# EAGLE design ZigFlea_v6 (EAGLE 5.08)
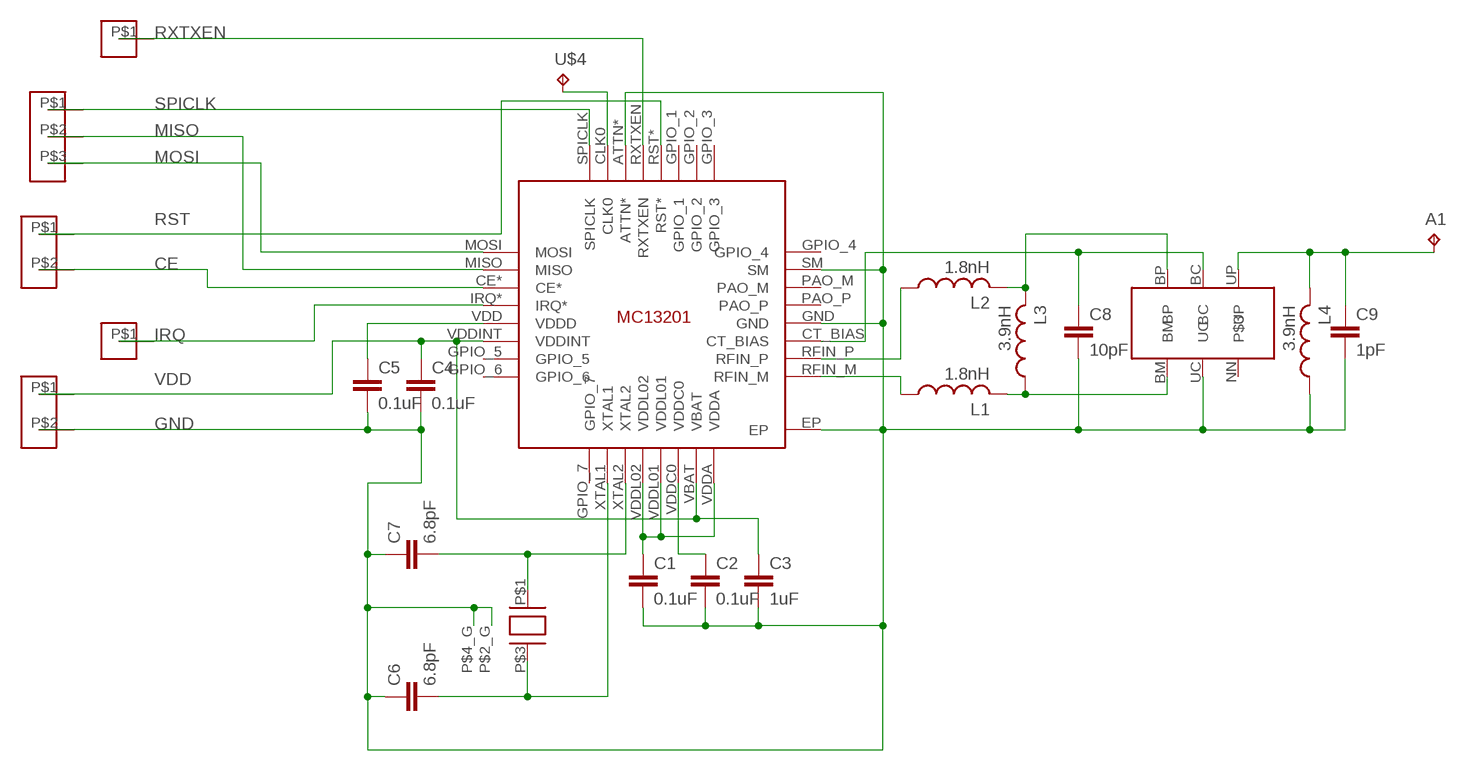
[diagram p0: schematic, sheet 1]

## Parts
A1  TPTP06SQ  [TP06SQ]
C1  0.1uF  C-EUC0603  [C0603]
C2  0.1uF  C-EUC0603  [C0603]
C3  1uF  C-EUC0603  [C0603]
C4  0.1uF  C-EUC0603  [C0603]
C5  0.1uF  C-EUC0603  [C0603]
C6  6.8pF  C-EUC0603  [C0603]
C7  6.8pF  C-EUC0603  [C0603]
C8  10pF  C-EUC0603  [C0603]
C9  1pF  C-EUC0603  [C0603]
L1  1.8nH  SPOLE0603  [SPOLE0603]
L2  1.8nH  SPOLE0603  [SPOLE0603]
L3  3.9nH  SPOLE0603  [SPOLE0603]
L4  3.9nH  SPOLE0603  [SPOLE0603]
RD8  PINHEAD1_1MM  [PINHEAD_1MM]
RE4  PINHEAD1_1MM  [PINHEAD_1MM]
U$1  MC13201  [MC13201]
U$2  16MHZ  [16MHZ]
U$3  BALUN  [BALUN]
U$4  TPTP06SQ  [TP06SQ]
U$5  PINHEAD3_1MM  [PINHEAD3_1MM]
U$6  PINHEAD2_1MM  [PINHEAD2_1MM]
U$7  PINHEAD2_1MM  [PINHEAD2_1MM]

## Nets
A1: A1.TP C9.1 L4.P$2 U$3.UP
CE: U$1.CE* U$6.P$2
GND: C1.2 C2.2 C3.2 C4.2 C5.2 C6.1 C7.1 C8.2 C9.2 L4.P$1 U$1.ATTN* U$1.EP U$1.GND U$1.SM U$2.P$2_G(P$3_G) U$2.P$4_G U$3.UC U$7.P$2
IRQ: RD8.P$1 U$1.IRQ*
MISO: U$1.MISO U$5.P$2
MOSI: U$1.MOSI U$5.P$3
N$1: C1.1 U$1.VDDA U$1.VDDL01 U$1.VDDL02
N$2: C2.1 U$1.VDDC0
N$3: U$1.CLK0 U$4.TP
N$4: C7.2 U$1.XTAL2 U$2.P$1
N$6: L1.P$1 U$1.RFIN_M
N$7: L2.P$1 U$1.RFIN_P
N$8: C5.1 U$1.VDD(VDDD)
N$9: C6.2 U$1.XTAL1 U$2.P$3
N$10: C8.1 U$1.CT_BIAS U$3.BC
N$11: L1.P$2 L3.P$1 U$3.BM
N$12: L2.P$2 L3.P$2 U$3.BP
RST: U$1.RST* U$6.P$1
RXTXEN: RE4.P$1 U$1.RXTXEN
SPICLK: U$1.SPICLK U$5.P$1
VDD: C3.1 C4.1 U$1.VBAT U$1.VDDINT U$7.P$1
Unconnected: U$1.GPIO_1 U$1.GPIO_2 U$1.GPIO_3 U$1.GPIO_4 U$1.GPIO_5 U$1.GPIO_6 U$1.GPIO_7 U$1.PAO_M U$1.PAO_P U$3.NN

## Library data of the parts
A1 U$4 = testpad:TP: Test pad
C1-C9 = resistor:C-EU: CAPACITOR, European symbol
L1-L4 = resistor:SPOLE0603
RD8 RE4 = Pinhead_my:PINHEAD1_1MM
U$1 = mc13201:MC13201
U$2 = mc13201:16MHZ
U$3 = freescale_16qfn:BALUN
U$5 = Pinhead_my:PINHEAD3_1MM
U$6 U$7 = Pinhead_my:PINHEAD2_1MM

## Board
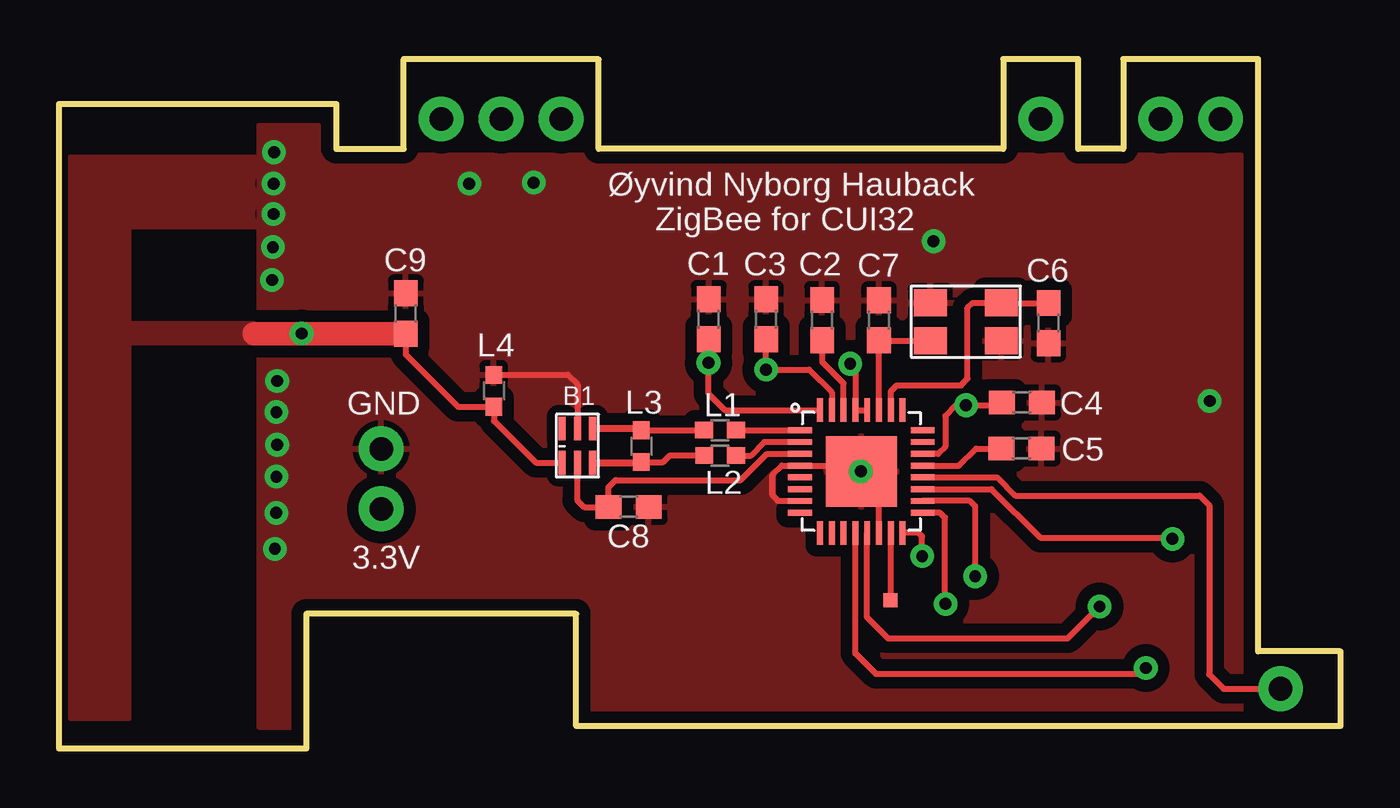
[diagram p1: board, top side]
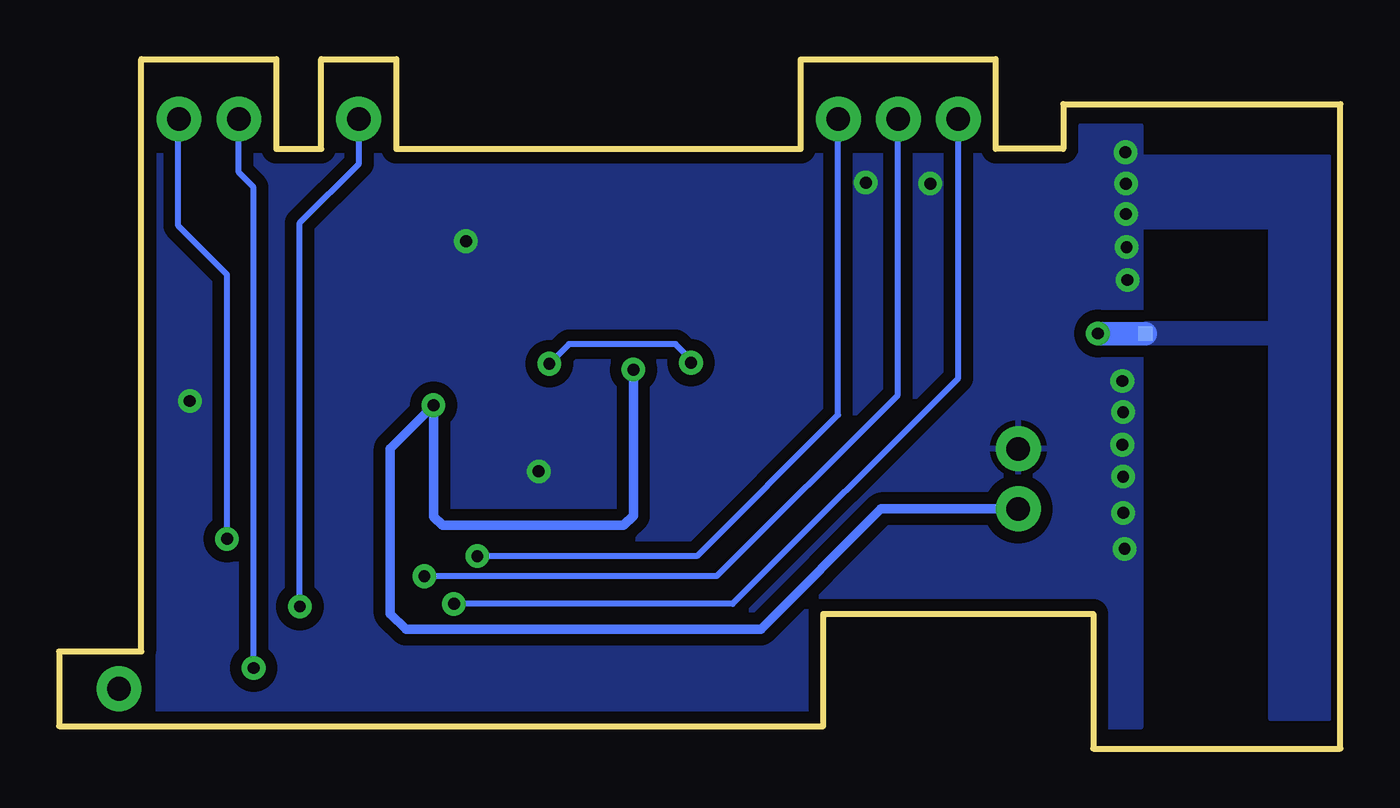
[diagram p2: board, bottom side, seen from below]

Size 54.29 x 29.21 mm. Coordinates in mm from the lower left corner, seen from the top.
Outline: 54.29,4.13 50.8,4.13 50.8,29.21 45.08,29.21 45.08,25.4 43.18,25.4 43.18,29.21 40,29.21 40,25.4 22.86,25.4 22.86,29.2 14.6,29.21 14.6,25.4 11.75,25.4 11.75,27.31 0,27.31 0,0 10.48,0 10.48,5.72 21.91,5.72 21.91,0.95 54.29,0.95 54.29,4.13
Copper layers (1*16): Top 0.035mm / dielectric 1.5mm / Bottom 0.035mm
Design rules "SeedDRC": minimum track width 6mil, minimum drill 10mil, track to track 6mil, track to pad 6mil, pad to pad 6mil, via to via 6mil, smd to smd 6mil, copper to edge 10mil, drill to drill 10mil, minimum pad ring 10mil, minimum via ring 6mil, stop-mask expansion 2mil, vias tented up to drill 100mil, thermal gap 10mil

### Footprints (pad centres in the part's own frame; a part is rotated, then mirrored left to right if it is on the bottom)
TP06SQ = smd 0.6 x 0.6: TP 0,0
C0603 = smd 1.1 x 1: 1 -0.85,0; 2 0.85,0
SPOLE0603 = smd 0.75 x 0.7: P$1 -0.675,0; P$2 0.675,0
PINHEAD_1MM = drill 1 pad 1.9 round: P$1 0,0
MC13201 = smd 0.25 x 1: ATTN* -0.75,2.6; CLK0 -1.25,2.6; GPIO_1 0.75,2.6; GPIO_2 1.25,2.6; GPIO_3 1.75,2.6; GPIO_7 -1.75,-2.6; RST* 0.25,2.6; RXTXEN -0.25,2.6; SPICLK -1.75,2.6; VBAT 1.25,-2.6; VDDA 1.75,-2.6; VDDC0 0.75,-2.6; VDDL01 0.25,-2.6; VDDL02 -0.25,-2.6; XTAL1 -1.25,-2.6; XTAL2 -0.75,-2.6 | smd 1 x 0.25: CE* -2.6,0.75; CT_BIAS 2.6,-0.75; GND 2.6,-0.25; GPIO_4 2.6,1.75; GPIO_5 -2.6,-1.25; GPIO_6 -2.6,-1.75; IRQ* -2.6,0.25; MISO -2.6,1.25; MOSI -2.6,1.75; PAO_M 2.6,0.75; PAO_P 2.6,0.25; RFIN_M 2.6,-1.75; RFIN_P 2.6,-1.25; SM 2.6,1.25; VDD -2.6,-0.25; VDDINT -2.6,-0.75 | smd 3 x 3: EP 0,0
16MHZ = smd 1.4 x 1.15: P$1 1.5,0.8; P$2_G 1.5,-0.8; P$3 -1.5,-0.8; P$4_G -1.5,0.8
BALUN = smd 0.3 x 1: BC 0.65,1.45; BM 0,0; BP 0,1.45; NN 1.3,0; UC 0.65,0; UP 1.3,1.45
PINHEAD3_1MM = drill 1 pad 1.9 round: P$1 0,2.54; P$2 0,0; P$3 0,-2.54
PINHEAD2_1MM = drill 1 pad 1.9 round: P$1 0,1.27; P$2 0,-1.27

### Placement (x,y rotation side)
A1  8.27,17.58 0 bottom
C1  27.53,18.19 90 top
C2  32.33,18.15 90 top
C3  29.96,18.18 90 top
C4  40.8,14.66 0 top
C5  40.77,12.71 0 top
C6  41.92,18.03 90 top
C7  34.74,18.14 270 top
C8  24.14,10.24 0 top
C9  14.69,18.43 90 top
L1  28,13.49 180 top
L2  28.01,12.42 180 top
L3  24.67,12.81 270 top
L4  18.42,15.16 270 top
RD8  51.75,2.54 0 top
RE4  41.59,26.67 0 top
U$1  33.99,11.74 180 top
U$2  38.42,18.08 180 top
U$3  22.61,13.56 180 top
U$4  35.23,6.29 180 top
U$5  18.73,26.67 270 top
U$6  47.94,26.67 90 top
U$7  13.65,11.43 180 top

### Tracks (layer width: path | path; a pad name or v marks a point on that pad's centre or on a via)
A1  (via drill 0.5 pad 1)
  Top 0.25: U$3.UP 20.2,12.11 18.42,13.89 18.42,14.47 L4.P$2 16.91,14.48 14.69,16.7 C9.1
  Top 1: C9.1 A1.TP v10.28,17.58
  Bottom 1: A1.TP v10.27,17.58 v10.28,17.58
  pour Top (isolate 0.254, no thermals): 8.52,22.08 8.52,25.08 0.47,25.08 0.47,1.28 2.97,1.28 2.97,17.18 8.27,17.18 8.27,18.03 2.97,18.03 2.97,22.08
  pour Bottom (no thermals): 8.27,18.03 2.97,18.03 2.97,22.08 8.52,22.08 8.52,25.08 0.47,25.08 0.47,1.28 2.97,1.28 2.97,17.18 8.27,17.18
CE  (via drill 0.5 pad 1)
  Top 0.25: U$1.CE* 39.51,10.99 41.57,8.94 47.13,8.94 v47.17,8.89
  Bottom 0.25: v47.17,8.89 47.17,20.08 49.24,22.14 49.24,26.64 U$6.P$2
GND  (via drill 0.5 pad 1)
  Top 0.25: U$1.ATTN* 34.74,10.99 U$1.EP 33.74,11.99 | C1.2 | U$3.UC 21.96,15.43 21.55,15.84 18.43,15.84 L4.P$1 | 33,11.99 32.99,11.99 U$1.GND 30.63,11.99 30.23,11.59 30.23,10.73 30.46,10.49 U$1.SM
  other vias: 9.06,21.24 37.05,21.49 9.03,19.85 9.21,9.99 9.21,11.52 9.15,8.46 33.97,11.75 9.24,12.88 9.21,14.26 9.24,15.58 9.09,22.64 9.09,23.93 9.11,25.26 17.38,23.93 20.11,23.97 48.75,14.73
  pour Bottom (isolate 0.5): 8.47,26.37 8.47,0.94 50.08,0.94 50.08,25.12 10.99,25.12 10.99,26.37
  pour Top (isolate 0.5): 8.47,26.37 8.47,0.94 50.08,0.94 50.08,25.12 10.99,25.12 10.99,26.37
IRQ
  Top 0.25: U$1.IRQ* 39.75,11.49 40.53,10.72 48.32,10.72 48.73,10.31 48.73,3.15 49.34,2.54 RD8.P$1
MISO  (via drill 0.5 pad 1)
  Top 0.25: U$1.MISO 38.59,10.49 38.82,10.27 v38.82,7.3
  Bottom 0.25: v38.82,7.3 26.43,7.3 18.76,14.98 18.76,26.64 U$5.P$2
MOSI  (via drill 0.5 pad 1)
  Top 0.25: U$1.MOSI 37.33,9.99 37.54,9.78 37.54,6.16 v37.56,6.13
  Bottom 0.25: v37.56,6.13 25.76,6.13 16.2,15.7 U$5.P$3
N$1  (via drill 0.5 pad 1)
  Top 0.25: U$1.VDDL02 U$1.VDDL01 33.74,16.08 v33.52,16.3 | U$1.VDDA 28.21,14.34 27.52,15.03 v27.52,16.34 C1.1
  Bottom 0.25: v27.52,16.34 27.56,16.39 27.56,16.53 28.17,17.14 32.69,17.14 v33.52,16.3
N$2
  Top 0.25: C2.1 32.34,17.29 32.34,16.38 33.24,15.47 U$1.VDDC0
N$3
  Top 0.25: U$1.CLK0 35.24,6.3 U$4.TP
N$4
  Top 0.25: U$1.XTAL2 C7.2 U$2.P$1
N$6
  Top 0.25: U$1.RFIN_M L1.P$1
N$7
  Top 0.25: U$1.RFIN_P 29.89,12.99 29.31,12.41 L2.P$1
N$8
  Top 0.25: U$1.VDD 38.13,11.99 38.86,12.72 C5.1 | C5.1
N$9
  Top 0.25: C6.2 U$2.P$3 38.71,18.89 38.49,18.67 38.49,15.67 38.21,15.39 35.5,15.39 35.24,15.14 U$1.XTAL1
N$10
  Top 0.25: U$1.CT_BIAS 29.99,12.49 28.88,11.38 23.59,11.38 23.28,11.06 23.28,10.25 C8.1 22.25,10.23 21.95,10.53 21.96,10.54 U$3.BC
N$11
  Top 0.25: L3.P$1 L1.P$2 | L3.P$1 | L3.P$1 24.64,13.49 24.57,13.56
  Top 0.3: U$3.BM 24.57,13.56
N$12
  Top 0.25: L3.P$2 24.75,12.05 | L2.P$2 25.89,12.42 25.6,12.13 L3.P$2 | L3.P$2 24.55,12.14 24.52,12.11
  Top 0.3: U$3.BP 24.52,12.11
RST  (via drill 0.5 pad 1)
  Top 0.25: U$1.RST* 33.74,4.04 34.61,3.17 45.81,3.17 v46.05,3.41
  Bottom 0.25: U$6.P$1 46.68,24.41 46.05,23.78 v46.05,3.41
RXTXEN  (via drill 0.5 pad 1)
  Top 0.25: U$1.RXTXEN 34.24,5.56 35.13,4.67 42.74,4.67 v44.09,6.02
  Bottom 0.25: v44.09,6.02 44.09,22.28 41.59,24.78 RE4.P$1
SPICLK  (via drill 0.5 pad 1)
  Top 0.25: U$1.SPICLK 36.42,9.14 36.57,8.99 v36.57,8.16
  Bottom 0.25: v36.57,8.16 27.27,8.16 21.29,14.13 21.29,26.66 U$5.P$1
VDD  (via drill 0.5 pad 1)
  Top 0.25: U$1.VDDINT 37.25,12.49 37.55,12.8 37.55,14.09 38.01,14.55 v38.43,14.55 39.83,14.55 C4.1 | v29.96,16.05 C3.1 | v29.96,16.05 | U$1.VBAT 32.74,15.09 31.78,16.05 v29.96,16.05
  Bottom 0.4: U$7.P$1 19.46,10.16 24.56,5.06 39.6,5.06 40.26,5.73 40.26,12.72 v38.43,14.55 38.43,9.84 38.05,9.45 30.37,9.45 29.96,9.87 v29.96,16.05

### Text on the board
tPlace: Øyvind Nyborg Hauback | ZigBee for CUI32 | GND | 3.3V
tNames: B1